# EAGLE design i2c_adc_1 (EAGLE 6.3)
DATABASE: ./../../eagle/PARTSDB.TXT
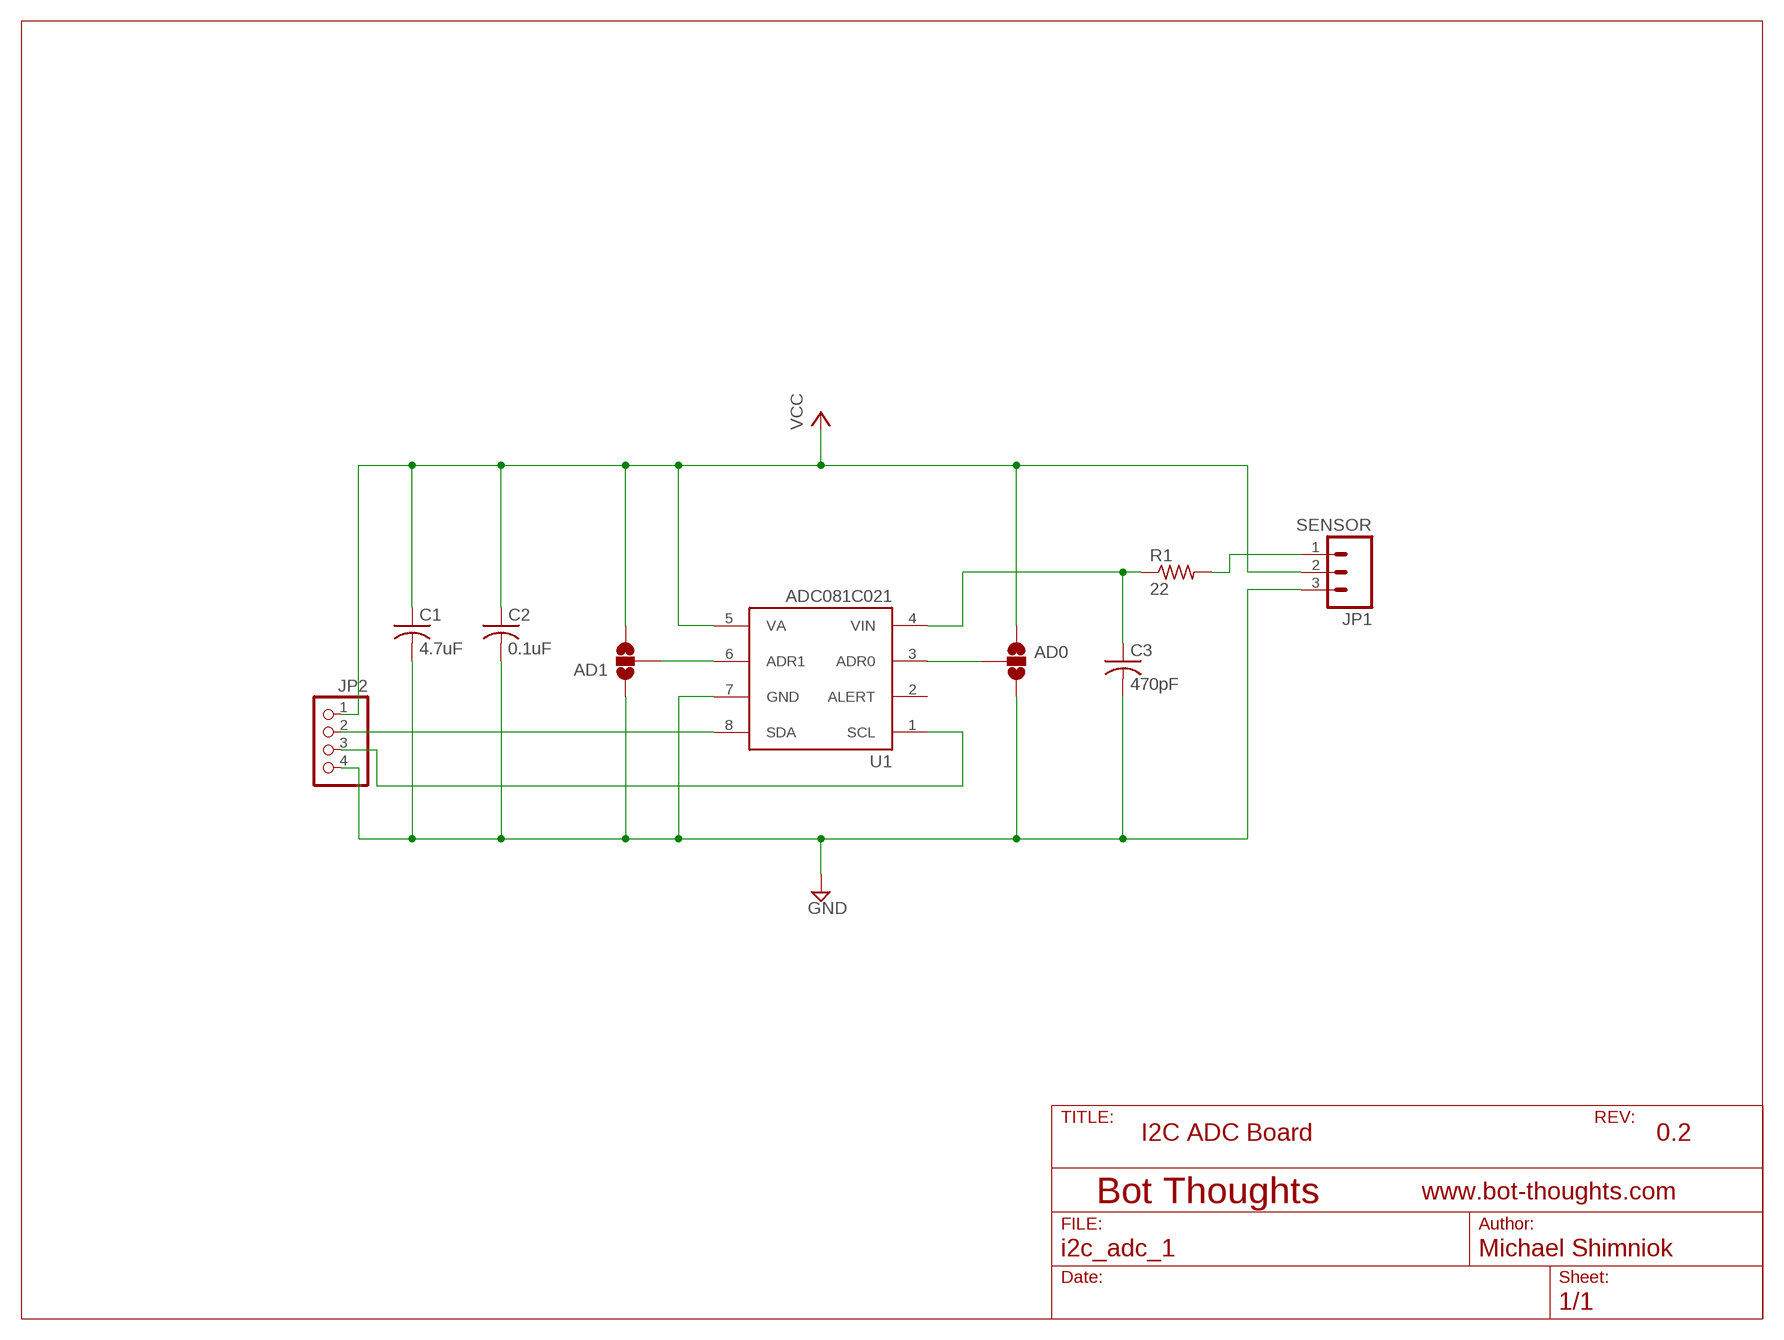
[diagram p0: schematic, sheet 1]

## Parts
AD0  SOLDERJUMPER_2WAYS  [SJ_3]
AD1  SOLDERJUMPER_2WAYS  [SJ_3]
C1  4.7uF  C-USC0603  [C0603]
C2  0.1uF  C-USC0603  [C0603]
C3  470pF  C-USC0603  [C0603]
JP1  SENSOR  M03PTH  [1X03]
JP2  PINHD-1X04_2.54-S  [1X04-S]
R1  22  R-US_R0603  [R0603]
U1  ADC081C021  [MSOP8_0.65]

## Nets
GND: AD0.3 AD1.1 C1.2 C2.2 C3.2 JP1.3 JP2.4 U1.7(GND)
N$1: JP1.1 R1.2
N$6: AD1.2 U1.6(ADR1)
N$7: AD0.2 U1.3(ADR0)
N$8: C3.1 R1.1 U1.4(VIN)
SCL: JP2.3 U1.1(SCL)
SDA: JP2.2 U1.8(SDA)
VCC: AD0.1 AD1.3 C1.1 C2.1 JP1.2 JP2.1 U1.5(VA)
Unconnected: U1.2(ALERT)

## Notes on the sheet
- I2C ADC Board | 0.2

## Library data of the parts
AD0 AD1 = SparkFun:SOLDERJUMPER_2WAY: Solder Jumper 2 way solder jumper
C1-C3 = rcl:C-US: CAPACITOR, American symbol
JP1 = SparkFun:M03: Header 3 Standard 3-pin 0.1" header. Use with straight break away headers (SKU : PRT-00116), right angle break away headers (PRT-00553), swiss pins (PRT-00743), machine pins (PRT-00117), and female headers (PRT-00115). Molex polarized connector foot print use with SKU : PRT-08232 with associated crimp pins and housings.
JP2 = pinhead-2:PINHD-1X04: PIN HEADER
R1 = rcl:R-US_: RESISTOR, American symbol
U1 = mes_adc:ADC081C021: ADC081C021 / ADC101C021 / ADC121C021 National Semiconductor I2C Analog to Digital Converter. 8-pin version. 6-pin variants either have single address line or alert line

## Board
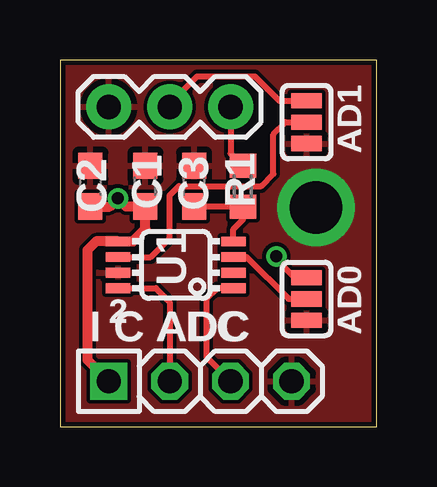
[diagram p1: board, top side]
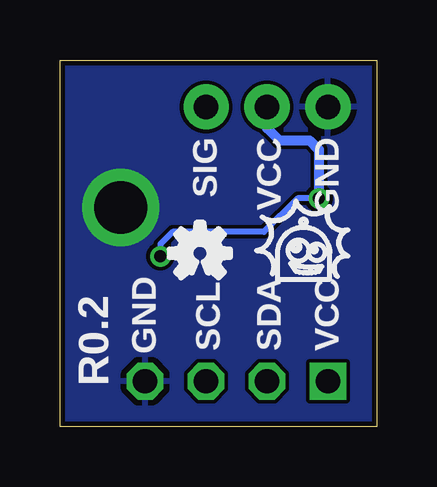
[diagram p2: board, bottom side, seen from below]

Size 13.2 x 15.29 mm. Coordinates in mm from the lower left corner, seen from the top.
Outline: 0,15.29 0,0 13.2,0 13.2,15.29 0,15.29
Copper layers (1*16): Top 0.0356mm / dielectric 1.5011mm / Bottom 0.0356mm
Design rules "default *": minimum track width 6mil, minimum drill 13mil, track to track 6mil, track to pad 6mil, pad to pad 6mil, via to via 6mil, smd to smd 6mil, copper to edge 8mil, drill to drill 6mil, minimum pad ring 7mil, minimum via ring 7mil, stop-mask expansion 4mil, vias tented up to drill 20mil, thermal gap 10mil

### Footprints (pad centres in the part's own frame; a part is rotated, then mirrored left to right if it is on the bottom)
SJ_3 = smd 0.635 x 1.27: 1 -0.889,0; 2 0,0; 3 0.889,0
C0603 = smd 1.1 x 1: 1 -0.85,0; 2 0.85,0
1X03 = drill 1.016 pad 1.88: 1 0,0; 2 2.54,0; 3 5.08,0
1X04-S = drill 1.016 square: 1 -3.81,0 | drill 1.016 octagon: 2 -1.27,0; 3 1.27,0; 4 3.81,0
R0603 = smd 1 x 1.1: 1 -0.85,0; 2 0.85,0
MSOP8_0.65 = smd 1.02 x 0.41: 1 -2.4,0.95; 2 -2.4,0.3; 3 -2.4,-0.35; 4 -2.4,-1; 5 2.4,-1; 6 2.4,-0.35; 7 2.4,0.3; 8 2.4,0.95

### Placement (x,y rotation side)
AD0  10.28,5.33 270 top
AD1  10.28,12.7 90 top
C1  3.56,10.03 90 top
C2  1.27,10.03 90 top
C3  5.59,10.03 90 top
JP1  7.11,13.34 180 top
JP2  5.84,1.91 0 top
R1  7.62,10.03 90 top
U1  4.83,6.73 180 top

### Tracks (layer width: path | path; a pad name or v marks a point on that pad's centre or on a via)
GND  (via drill 2.2)
  other vias: 10.67,9.14
  pour Bottom: 0,15.24 13.21,15.24 13.08,0 -0.13,0
  pour Top: 13.19,15.18 13.19,-0.11 -0.01,-0.11 -0.01,15.18
N$1
  Top 0.254: JP1.1 7.11,11.39 R1.2
N$6
  Top 0.254: U1.6 3.78,7.08 4.57,7.87 4.57,9.65 4.95,10.03 8.38,10.03 8.89,10.54 8.89,12.19 9.4,12.7 AD1.2
N$7
  Top 0.254: U1.3 7.78,7.08 9.53,5.33 AD0.2
N$8
  Top 0.254: C3.1 R1.1 7.62,8.64 7.23,8.24 U1.4
SCL
  Top 0.254: U1.1 6.54,5.78 6.1,5.33 6.1,2.92 JP2.3
SDA
  Top 0.254: U1.8 4,5.78 4.57,5.21 JP2.2
VCC  (via drill 0.5)
  Top 0.254: JP1.2 4.57,13.46 5.71,14.61 8.12,14.61 9.14,13.59 AD1.3 | AD0.1 9.78,6.22 9.02,6.99 v9.02,7.11
  Top 0.406: C2.1 2.07,9.18 v2.41,9.53 2.75,9.18 C1.1 3.56,8.26 3.03,7.73 U1.5 1.51,7.73 1.14,7.37 1.14,2.79 JP2.1
  Bottom 0.254: v2.41,9.53 3.3,9.53 4.7,8.13 8.51,8.13 9.02,7.62 v9.02,7.11
  Bottom 0.406: JP1.2 4.57,12.45 4.06,11.94 2.79,11.94 2.41,11.56 v2.41,9.53

### Text on the board
bPlace: R0.2
tNames: I C ADC | 2
bNames: GND | VCC | SIG | VCC | SDA | SCL | GND
_tsilk: AD1 | C2 | C1 | C3 | R1 | U1 | AD0 | I C ADC | 2
_bsilk: GND | VCC | SIG | VCC | SDA | SCL | GND | R0.2